# EAGLE design mcu_teensy4.1 (EAGLE 9.6.1)
c't-Bot v2 MCU Board; CC BY-SA 4.0, Timo Sandmann
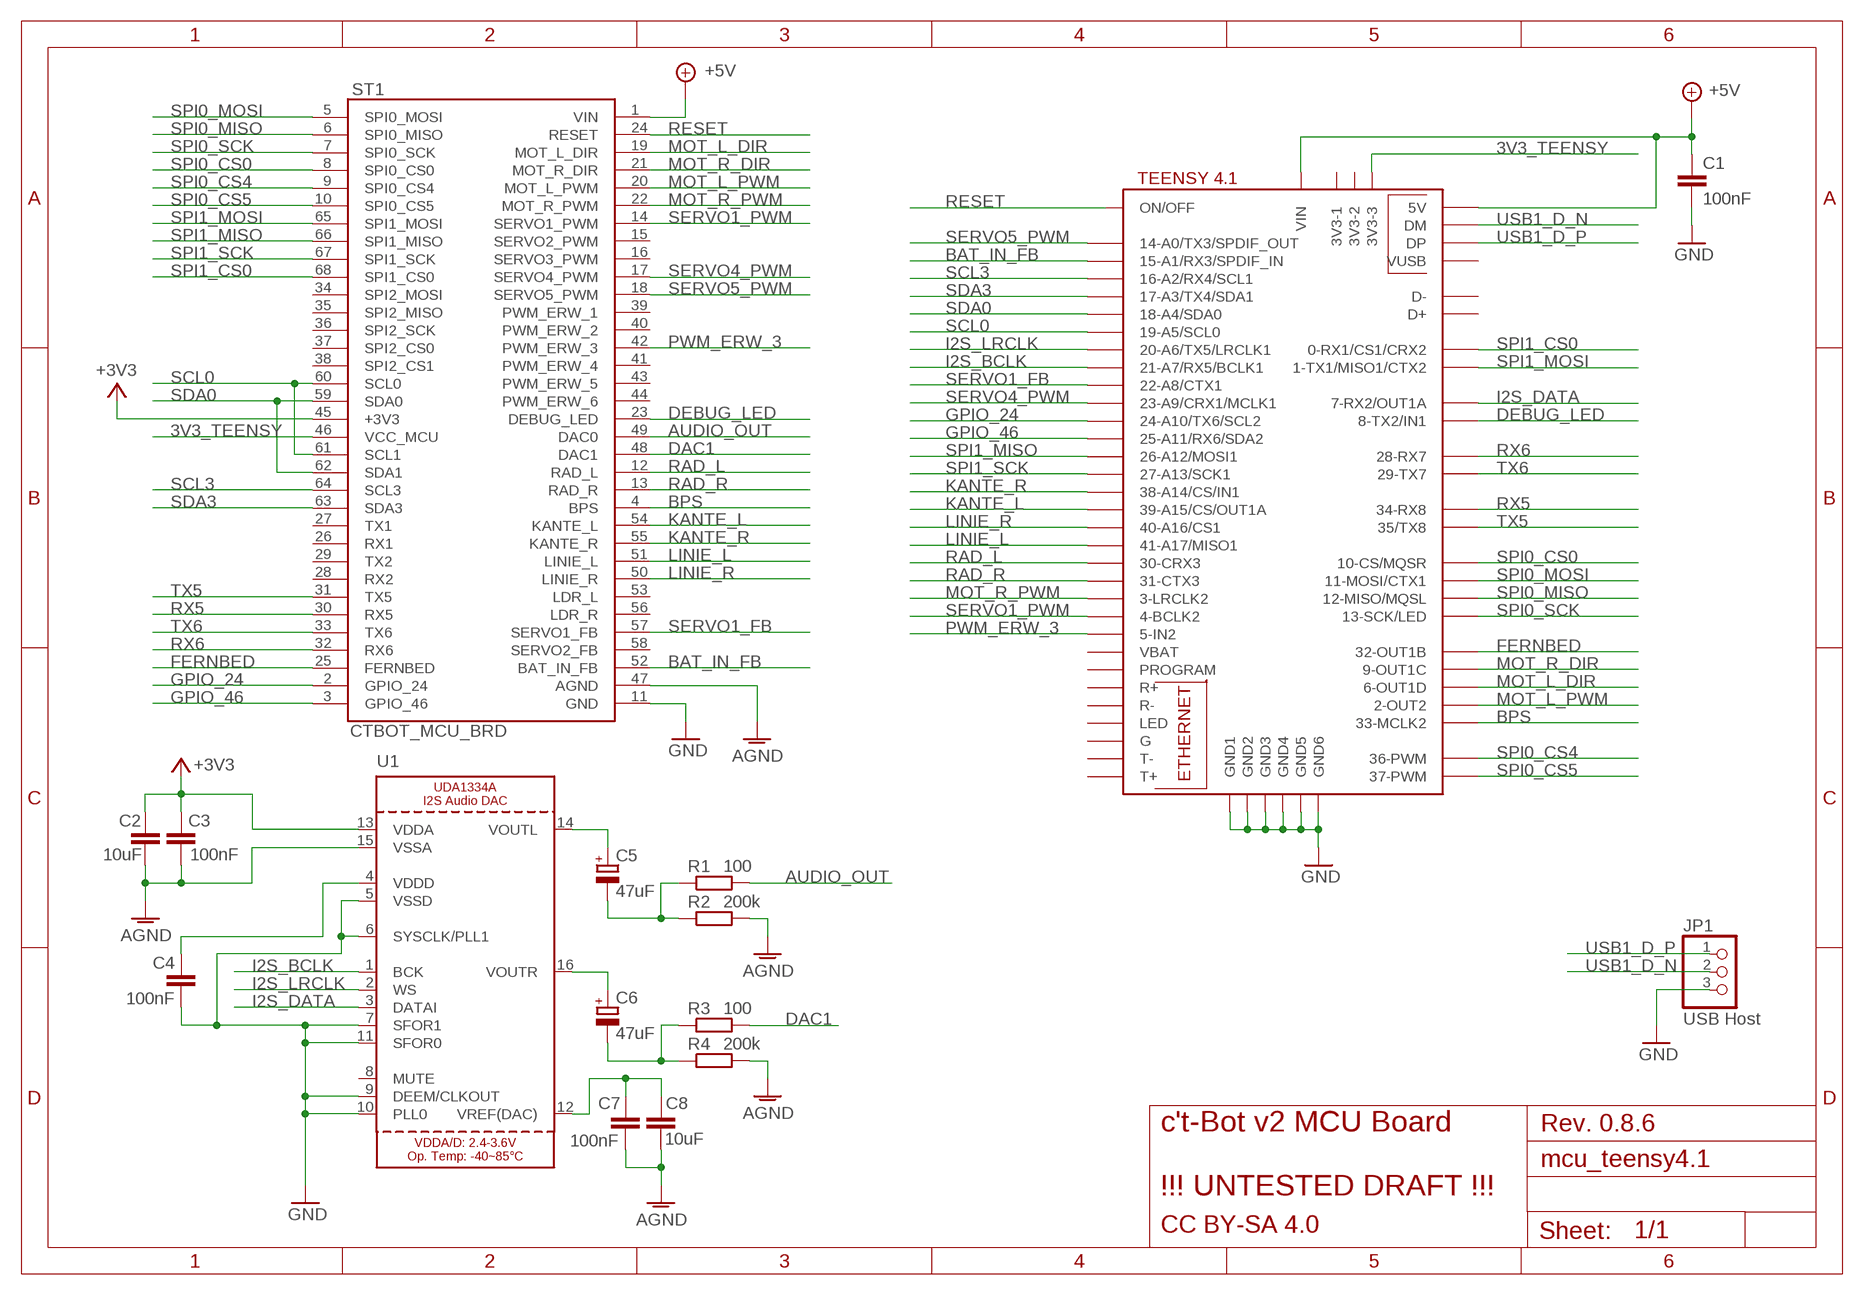
[diagram p0: schematic, sheet 1]

## Parts
C1  100nF  C-EUC0805  [C0805]
C2  10uF  C-EUC0805  [C0805]
C3  100nF  C-EUC0805  [C0805]
C4  100nF  C-EUC0805  [C0805]
C5  47uF  CPOL-EUUD-6,3X8,8  [UD-6,3X5,8_NICHICON]
C6  47uF  CPOL-EUUD-6,3X8,8  [UD-6,3X5,8_NICHICON]
C7  100nF  C-EUC0805  [C0805]
C8  10uF  C-EUC0805  [C0805]
JP1  USB Host  PINHD-1X3/90  [1X03/90]
R1  100  R-EU_R0805  [R0805]
R2  200k  R-EU_R0805  [R0805]
R3  100  R-EU_R0805  [R0805]
R4  200k  R-EU_R0805  [R0805]
ST1  CTBOT_MCU_BRD  [DIP66]
U1  AUDIO_I2S_UDA1334""  [SSOP16_4.4MM]
U$1  TEENSY41  [TEENSY41]

## Nets
3V3_TEENSY: ST1.46(VCC_MCU) U$1.3V3-3
+3V3: C2.1 C3.2 ST1.45(+3V3) U1.13(VDDA)
+5V: C1.1 ST1.1(VIN) U$1.+5V(5V) U$1.VIN
AGND: C2.2 C3.1 C7.1 C8.1 R2.2 R4.2 ST1.47(AGND) U1.15(VSSA)
AUDIO_OUT: R1.2 ST1.49(DAC0)
BAT_IN_FB: ST1.52(BAT_IN_FB) U$1.15-A1/RX3/SPDIF_IN
BPS: ST1.4(BPS) U$1.33-MCLK2
DAC1: R3.2 ST1.48(DAC1)
DEBUG_LED: ST1.23(DEBUG_LED) U$1.8-TX2/IN1
FERNBED: ST1.25(FERNBED) U$1.32-OUT1B
GND: C1.2 C4.1 JP1.3 ST1.11(GND) U1.5(VSSD) U1.6(SYSCLK/PLL1) U1.7(SFOR1) U1.9(DEEM/CLKOUT) U1.10(PLL0) U1.11(SFOR0) U$1.GND1 U$1.GND2 U$1.GND3 U$1.GND4 U$1.GND5 U$1.GND6
GPIO_24: ST1.2(GPIO_24) U$1.24-A10/TX6/SCL2
GPIO_46: ST1.3(GPIO_46) U$1.25-A11/RX6/SDA2
I2S_BCLK: U1.1(BCK) U$1.21-A7/RX5/BCLK1
I2S_DATA: U1.3(DATAI) U$1.7-RX2/OUT1A
I2S_LRCLK: U1.2(WS) U$1.20-A6/TX5/LRCLK1
KANTE_L: ST1.54(KANTE_L) U$1.39-A15/CS/OUT1A
KANTE_R: ST1.55(KANTE_R) U$1.38-A14/CS/IN1
LINIE_L: ST1.51(LINIE_L) U$1.41-A17/MISO1
LINIE_R: ST1.50(LINIE_R) U$1.40-A16/CS1
MOT_L_DIR: ST1.19(MOT_L_DIR) U$1.6-OUT1D
MOT_L_PWM: ST1.20(MOT_L_PWM) U$1.2-OUT2
MOT_R_DIR: ST1.21(MOT_R_DIR) U$1.9-OUT1C
MOT_R_PWM: ST1.22(MOT_R_PWM) U$1.3-LRCLK2
N$1: C7.2 C8.2 U1.12(VREF(DAC))
N$2: C5.+ U1.14(VOUTL)
N$3: C4.2 U1.4(VDDD)
N$4: C6.+ U1.16(VOUTR)
N$5: C5.- R1.1 R2.1
N$6: C6.- R3.1 R4.1
PWM_ERW_3: ST1.42(PWM_ERW_3) U$1.5-IN2
RAD_L: ST1.12(RAD_L) U$1.30-CRX3
RAD_R: ST1.13(RAD_R) U$1.31-CTX3
RESET: ST1.24(RESET) U$1.ON/OFF
RX5: ST1.30(RX5) U$1.34-RX8
RX6: ST1.32(RX6) U$1.28-RX7
SCL0: ST1.60(SCL0) ST1.61(SCL1) U$1.19-A5/SCL0
SCL3: ST1.64(SCL3) U$1.16-A2/RX4/SCL1
SDA0: ST1.59(SDA0) ST1.62(SDA1) U$1.18-A4/SDA0
SDA3: ST1.63(SDA3) U$1.17-A3/TX4/SDA1
SERVO1_FB: ST1.57(SERVO1_FB) U$1.22-A8/CTX1
SERVO1_PWM: ST1.14(SERVO1_PWM) U$1.4-BCLK2
SERVO4_PWM: ST1.17(SERVO4_PWM) U$1.23-A9/CRX1/MCLK1
SERVO5_PWM: ST1.18(SERVO5_PWM) U$1.14-A0/TX3/SPDIF_OUT
SPI0_CS0: ST1.8(SPI0_CS0) U$1.10-CS\MQSR(10-CS/MQSR)
SPI0_CS4: ST1.9(SPI0_CS4) U$1.36-PWM
SPI0_CS5: ST1.10(SPI0_CS5) U$1.37-PWM
SPI0_MISO: ST1.6(SPI0_MISO) U$1.12-MISO/MQSL
SPI0_MOSI: ST1.5(SPI0_MOSI) U$1.11-MOSI/CTX1
SPI0_SCK: ST1.7(SPI0_SCK) U$1.13-SCK/LED
SPI1_CS0: ST1.68(SPI1_CS0) U$1.0-RX1/CS1/CRX2
SPI1_MISO: ST1.66(SPI1_MISO) U$1.26-A12/MOSI1
SPI1_MOSI: ST1.65(SPI1_MOSI) U$1.1-TX1/MISO1/CTX2
SPI1_SCK: ST1.67(SPI1_SCK) U$1.27-A13/SCK1
TX5: ST1.31(TX5) U$1.35-TX8(35/TX8)
TX6: ST1.33(TX6) U$1.29-TX7
USB1_D_N: JP1.2 U$1.DM
USB1_D_P: JP1.1 U$1.DP
Unconnected: ST1.15(SERVO2_PWM) ST1.16(SERVO3_PWM) ST1.26(RX1) ST1.27(TX1) ST1.28(RX2) ST1.29(TX2) ST1.34(SPI2_MOSI) ST1.35(SPI2_MISO) ST1.36(SPI2_SCK) ST1.37(SPI2_CS0) ST1.38(SPI2_CS1) ST1.39(PWM_ERW_1) ST1.40(PWM_ERW_2) ST1.41(PWM_ERW_4) ST1.43(PWM_ERW_5) ST1.44(PWM_ERW_6) ST1.53(LDR_L) ST1.56(LDR_R) ST1.58(SERVO2_FB) U1.8(MUTE) U$1.3V3-1 U$1.3V3-2 U$1.D+ U$1.D- U$1.G U$1.LED U$1.PROGRAM U$1.R+ U$1.R- U$1.T+ U$1.T- U$1.VBAT U$1.VUSB

## Notes on the sheet
- Rev. 0.8.6
- c't-Bot v2 MCU Board
  
  !!! UNTESTED DRAFT !!!
- CC BY-SA 4.0

## Library data of the parts
C1-C4 C7 C8 = rcl:C-EU: CAPACITOR, European symbol; SPICEPREFIX: C
C5 C6 = rcl:CPOL-EU: POLARIZED CAPACITOR, European symbol; SPICEPREFIX: C
JP1 = pinhead_ts:PINHD-1X3: PIN HEADER
R1-R4 = rcl:R-EU_: RESISTOR, European symbol; SPICEPREFIX: R
ST1 = ct-bot:CTBOT_MCU_BRD
U1 = ct-bot:AUDIO_I2S_UDA1334: UDA1334 I2C Audio DAC Power Supply: 2.4-3.6V Sample frequencies from 16-100kHz
U$1 = teensy:TEENSY41

## Board
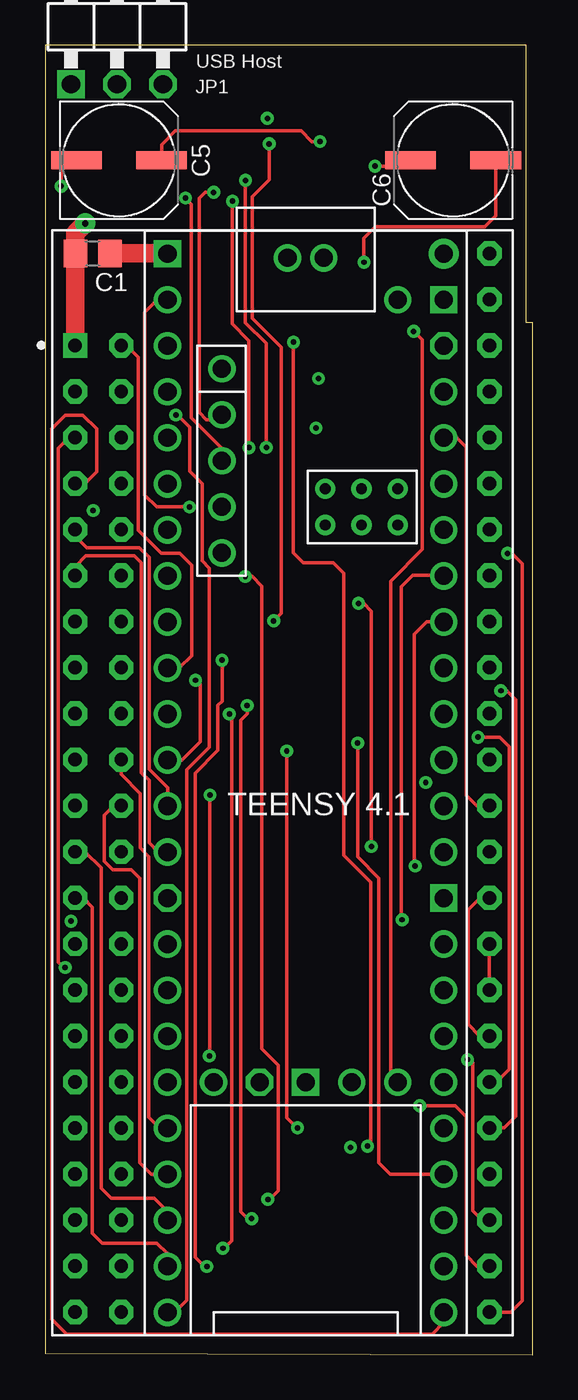
[diagram p1: board, top side]
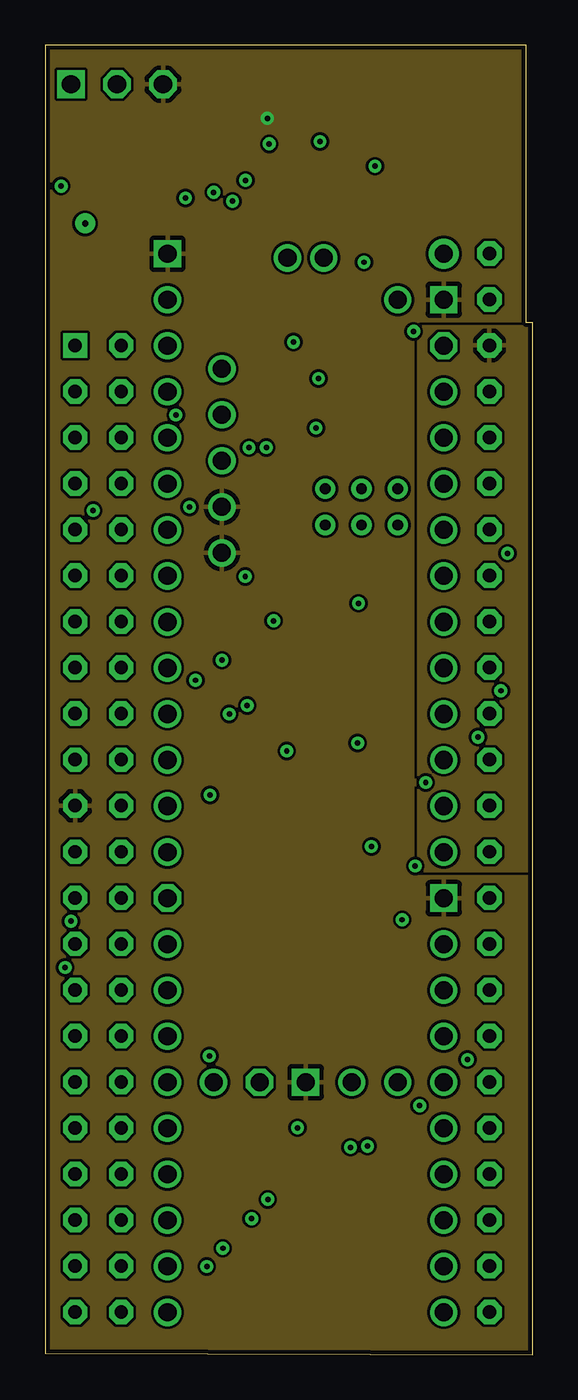
[diagram p2: board, inner layer GND]
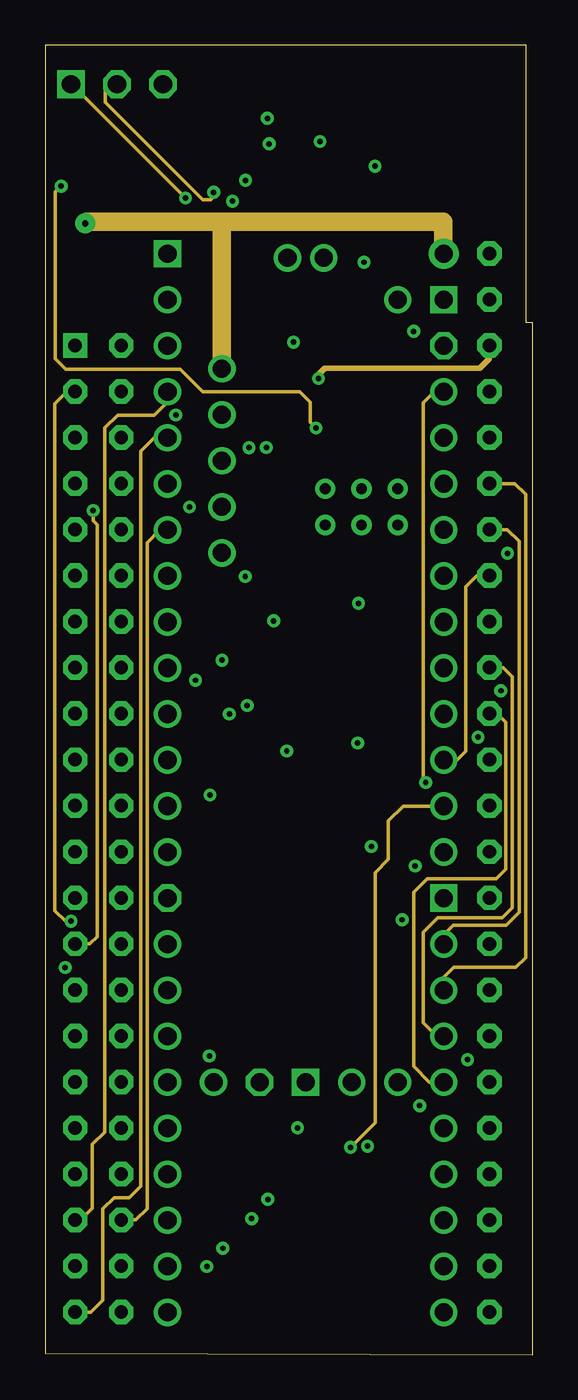
[diagram p3: board, inner layer ANALOG]
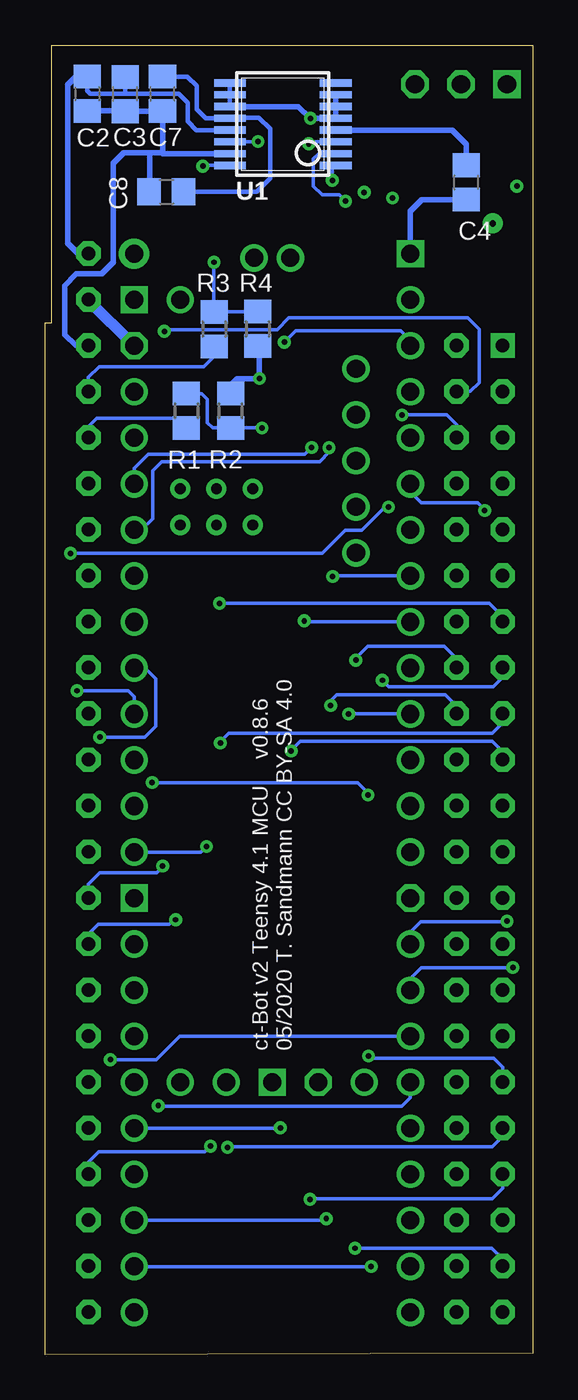
[diagram p4: board, bottom side, seen from below]

Size 26.89 x 72.25 mm. Coordinates in mm from the lower left corner, seen from the top.
Outline: 0,0.07 26.89,0 26.89,56.95 26.54,56.95 26.54,72.25 0,72.25 0,0.07
Copper layers (1+2*15+16): Top 0.035mm / dielectric 0.2mm / GND 0.0175mm / dielectric 1.065mm / ANALOG 0.0175mm / dielectric 0.2mm / Bottom 0.035mm
Design rules "jlcpcb_4layer_DRU": minimum track width 6mil, minimum drill 0.3mm, track to track 6mil, track to pad 6mil, pad to pad 6mil, via to via 6mil, smd to smd 6mil, copper to edge 10mil, drill to drill 6mil, minimum pad ring 10mil, minimum via ring 8mil, stop-mask expansion 4mil, vias tented up to drill 0mil, thermal gap 10mil

### Footprints (pad centres in the part's own frame; a part is rotated, then mirrored left to right if it is on the bottom)
C0805 = smd 1.3 x 1.5: 1 -0.95,0; 2 0.95,0
UD-6,3X5,8_NICHICON = smd 2.8 x 1: + 2.35,0; - -2.35,0
1X03/90 = drill 1.016 square: 1 -2.54,-3.81 | drill 1.016 octagon: 2 0,-3.81; 3 2.54,-3.81
R0805 = smd 1.3 x 1.5: 1 -0.95,0; 2 0.95,0
DIP66 = drill 0.743 pad 1.343 square: 1 -11.43,25.4 | drill 0.743 pad 1.343 octagon: 2 -11.43,22.86; 3 -11.43,20.32; 4 -11.43,17.78; 5 -11.43,15.24; 6 -11.43,12.7; 7 -11.43,10.16; 8 -11.43,7.62; 9 -11.43,5.08; 10 -11.43,2.54; 11 -11.43,0; 12 -11.43,-2.54; 13 -11.43,-5.08; 14 -11.43,-7.62; 15 -11.43,-10.16; 16 -11.43,-12.7; 17 -11.43,-15.24; 18 -11.43,-17.78; 19 -11.43,-20.32; 20 -11.43,-22.86; 21 -11.43,-25.4; 22 -11.43,-27.94; 23 -8.89,25.4; 24 -8.89,22.86; 25 -8.89,20.32; 26 -8.89,17.78; 27 -8.89,15.24; 28 -8.89,12.7; 29 -8.89,10.16; 30 -8.89,7.62; 31 -8.89,5.08; 32 -8.89,2.54; 33 -8.89,0; 34 -8.89,-2.54; 35 -8.89,-5.08; 36 -8.89,-7.62; 37 -8.89,-10.16; 38 -8.89,-12.7; 39 -8.89,-15.24; 40 -8.89,-17.78; 41 -8.89,-20.32; 42 -8.89,-22.86; 43 -8.89,-25.4; 44 -8.89,-27.94; 45 11.43,30.48; 46 11.43,27.94; 47 11.43,25.4; 48 11.43,22.86; 49 11.43,20.32; 50 11.43,17.78; 51 11.43,15.24; 52 11.43,12.7; 53 11.43,10.16; 54 11.43,7.62; 55 11.43,5.08; 56 11.43,2.54; 57 11.43,0; 58 11.43,-2.54; 59 11.43,-5.08; 60 11.43,-7.62; 61 11.43,-10.16; 62 11.43,-12.7; 63 11.43,-15.24; 64 11.43,-17.78; 65 11.43,-20.32; 66 11.43,-22.86; 67 11.43,-25.4; 68 11.43,-27.94
SSOP16_4.4MM = smd 0.4 x 1.75: 1 -2.275,-2.92; 2 -1.625,-2.92; 3 -0.975,-2.92; 4 -0.325,-2.92; 5 0.325,-2.92; 6 0.975,-2.92; 7 1.625,-2.92; 8 2.275,-2.92; 9 2.275,2.92; 10 1.625,2.92; 11 0.975,2.92; 12 0.325,2.92; 13 -0.325,2.92; 14 -0.975,2.92; 15 -1.625,2.92; 16 -2.275,2.92
TEENSY41 = drill 1: 0-RX1/CS1/CRX2 -27.94,-7.62; 1-TX1/MISO1/CTX2 -25.4,-7.62; 2-OUT2 -22.86,-7.62; 3-LRCLK2 -20.32,-7.62; 4-BCLK2 -17.78,-7.62; 5-IN2 -15.24,-7.62; 6-OUT1D -12.7,-7.62; 7-RX2/OUT1A -10.16,-7.62; 8-TX2/IN1 -7.62,-7.62; 9-OUT1C -5.08,-7.62; 10-CS\MQSR -2.54,-7.62; 11-MOSI/CTX1 0,-7.62; 12-MISO/MQSL 2.54,-7.62; 13-SCK/LED 2.54,7.62; 14-A0/TX3/SPDIF_OUT 0,7.62; 15-A1/RX3/SPDIF_IN -2.54,7.62; 16-A2/RX4/SCL1 -5.08,7.62; 17-A3/TX4/SDA1 -7.62,7.62; 18-A4/SDA0 -10.16,7.62; 19-A5/SCL0 -12.7,7.62; 20-A6/TX5/LRCLK1 -15.24,7.62; 21-A7/RX5/BCLK1 -17.78,7.62; 22-A8/CTX1 -20.32,7.62; 23-A9/CRX1/MCLK1 -22.86,7.62; 24-A10/TX6/SCL2 7.62,-7.62; 25-A11/RX6/SDA2 10.16,-7.62; 26-A12/MOSI1 12.7,-7.62; 27-A13/SCK1 15.24,-7.62; 28-RX7 17.78,-7.62; 29-TX7 20.32,-7.62; 30-CRX3 22.86,-7.62; 31-CTX3 25.4,-7.62; 32-OUT1B 27.94,-7.62; 33-MCLK2 27.94,7.62; 34-RX8 25.4,7.62; 35-TX8 22.86,7.62; 36-PWM 20.32,7.62; 37-PWM 17.78,7.62; 38-A14/CS/IN1 15.24,7.62; 39-A15/CS/OUT1A 12.7,7.62; 40-A16/CS1 10.16,7.62; 41-A17/MISO1 7.62,7.62; +5V -24.13,-4.62; D+ -30.25,-1; D- -30.25,1; DM -21.59,-4.62; DP -19.05,-4.62; GND4 -16.51,-4.62; GND5 -13.97,-4.62; ON/OFF 15.24,5.08; PROGRAM 15.24,2.54; VBAT 15.24,-5.08; VUSB -27.94,5.08 | drill 1 octagon: 3V3-1 5.08,-7.62; 3V3-2 15.24,-2.54; 3V3-3 -25.4,7.62 | drill 0.6: G -15.51,3.08; LED -17.51,3.08; R+ -17.51,5.08; R- -15.51,5.08; T+ -15.51,1.08; T- -17.51,1.08 | drill 1 square: GND1 -30.48,-7.62; GND2 15.24,0; GND3 5.08,7.62; GND6 -27.94,7.62 | drill 1 pad 1.676: VIN -30.48,7.62

### Placement (x,y rotation side)
C1  2.61,60.77 0 top
C2  24.58,69.58 270 bottom
C3  22.48,69.57 90 bottom
C4  3.66,64.69 90 bottom
C5  4.07,65.91 0 top
C6  22.5,65.91 180 top
C7  20.42,69.57 90 bottom
C8  20.21,64.17 0 bottom
JP1  3.96,73.91 0 top
R1  19.1,52.09 270 bottom
R2  16.66,52.09 90 bottom
R3  17.57,56.59 270 bottom
R4  15.17,56.6 270 bottom
ST1  13.08,30.29 0 top
U1  13.78,67.9 90 bottom
U$1  14.37,30.27 270 top

### Tracks (layer width: path | path; a pad name or v marks a point on that pad's centre or on a via)
3V3_TEENSY
  Bottom 0.61: U$1.3V3-3 24.51,58.2 ST1.46
+3V3
  Bottom 0.254: 22.48,69.58 19.52,69.58 19.03,69.1 19.03,68.05 18.56,67.58 U1.13 | C3.2 22.48,69.58 | 22.48,69.58 24.41,69.58 24.58,69.75 24.58,70.19
  Bottom 0.305: 24.58,70.19 C2.1 24.59,70.54 25.18,70.54 25.64,70.08 25.64,61.32 25.1,60.77 ST1.45
+5V  (via drill 0.35 pad 1.1)
  Top 1.016: ST1.1 1.65,60.76 C1.1 1.66,61.89 v2.2,62.43
  ANALOG 1.016: 9.8,62.5 2.28,62.5 v2.2,62.43 | U$1.+5V 9.75,62.45 9.8,62.5 | 9.8,62.5 21.95,62.5 21.95,60.79 U$1.VIN
AGND  (via drill 0.3)
  ANALOG 0.305: ST1.47 24.51,54.96 23.98,54.43 15.42,54.43 15.07,54.08 v15.07,53.87
  Bottom 0.305: ST1.47 25.21,55.69 25.81,56.29 25.81,59 25.17,59.64 23.78,59.64 23.13,60.29 23.13,65.75 22.56,66.31 21.14,66.31 | U1.15 20.42,66.28 20.42,66.31 | 20.42,66.31 21.14,66.31 | 20.42,66.31 C7.1 C3.1 22.5,68.63 C2.2 | C8.1 21.14,64.2 21.14,66.31 | R4.2 15.07,55.55 v15.07,53.87 16.29,53.87 16.66,53.49 R2.2
  pour GND (rank 2): 20.6,56.72 28.14,56.72 28.14,26.7 20.6,26.7
AUDIO_OUT
  Bottom 0.203: ST1.49 24.51,51.22 24.04,51.68 19.53,51.68 19.1,51.26 R1.2
BAT_IN_FB
  ANALOG 0.203: U$1.15-A1/RX3/SPDIF_IN 22.71,32.81 23.2,33.31 23.2,42.38 23.81,42.99 ST1.52
BPS
  Top 0.203: U$1.33-MCLK2 21.99,1.78 21.34,1.14 2.9,1.14 1.18,1.14 0.36,1.96 0.36,51.09 1.11,51.84 2.08,51.84 2.83,51.09 2.83,48.72 2.19,48.07 ST1.4
DAC1
  Bottom 0.203: R3.2 17.57,55.11 18.15,54.53 23.91,54.53 24.51,53.93 ST1.48
DEBUG_LED
  Top 0.203: U$1.8-TX2/IN1 7.4,37.89 8.08,38.58 8.08,43.56 7.41,44.23 6.39,44.23 5.14,45.49 5.14,55.03 4.48,55.69 ST1.23
FERNBED  (via drill 0.3)
  Top 0.203: U$1.32-OUT1B 7.14,2.33 7.8,2.99 7.8,32.27 9.05,33.52 9.05,43.4 8.65,43.8 8.65,48.05 7.96,48.74 7.96,51.18 7.29,51.86 v7.21,51.86
  Bottom 0.203: v7.21,51.86 4.73,51.86 4.19,51.31 ST1.25
GND  (via drill 0.3)
  Top 1.016: C1.2 U$1.GND1
  Bottom 0.254: U1.11 U1.10 | U1.10 U1.9 | U1.7 | U1.10
  Bottom 0.305: U1.7 U1.6 U1.5 v12.25,68.23 v12.25,68.22 12.27,68.22 12.93,68.88 U1.11 | C4.1 6.11,63.74 6.75,63.1 U$1.GND1
  pour GND (rank 6): -0.89,72.63 28.5,72.63 28.5,-0.44 -0.89,-0.44
GPIO_24  (via drill 0.3)
  ANALOG 0.203: v1.42,23.92 1.11,23.92 0.53,24.51 0.53,52.48 1.2,53.15 ST1.2
  Bottom 0.203: U$1.24-A10/TX6/SCL2 6.75,23.31 6.16,23.89 1.45,23.89 v1.42,23.92
GPIO_46  (via drill 0.3)
  Top 0.203: v1.09,21.36 1.03,21.36 0.72,21.67 0.72,50.02 1.32,50.61 ST1.3
  Bottom 0.203: U$1.25-A11/RX6/SDA2 6.75,20.75 6.14,21.35 v1.1,21.35 v1.09,21.36
I2S_BCLK  (via drill 0.3)
  Top 0.203: v11.05,64.8 11.05,64.78 11.04,64.78 11.04,56.96 12.19,55.8 v12.19,50.06
  Bottom 0.203: U$1.21-A7/RX5/BCLK1 21.99,48.9 21.21,49.68 12.57,49.68 v12.19,50.06 | v11.05,64.8 11.06,64.81 11.06,65.43 U1.1
I2S_DATA  (via drill 0.3)
  Top 0.203: v12.35,66.82 12.35,64.84 11.42,63.9 11.42,57.19 13.03,55.58 13.03,40.93 v12.6,40.5
  Bottom 0.203: U$1.7-RX2/OUT1A 12.54,40.43 v12.6,40.5 | U1.3 12.25,66.93 v12.35,66.83 v12.35,66.82
I2S_LRCLK  (via drill 0.3)
  Top 0.203: v11.24,50.05 11.24,55.95 10.32,56.88 v10.32,63.64 v10.33,63.65
  Bottom 0.203: U$1.20-A6/TX5/LRCLK1 21.59,45.51 20.97,46.13 20.97,48.78 20.47,49.28 11.75,49.28 11.24,49.79 v11.24,50.05 | U1.2 11.81,66.28 12.1,65.99 12.1,64.47 11.62,63.99 10.67,63.99 v10.33,63.65
KANTE_L
  ANALOG 0.203: ST1.54 25.28,37.91 25.78,37.42 25.78,24.67 25.22,24.11 21.64,24.11 20.85,23.32 20.85,18.32 21.6,17.57 U$1.39-A15/CS/OUT1A
KANTE_R
  ANALOG 0.203: ST1.55 24.92,35.37 25.4,34.89 25.4,26.77 24.89,26.26 21.09,26.26 20.33,25.5 20.33,15.9 21.2,15.03 U$1.38-A14/CS/IN1
LINIE_L
  ANALOG 0.203: ST1.51 25.5,45.53 26.14,44.89 26.14,24.41 25.42,23.7 22.51,23.7 21.99,23.17 U$1.41-A17/MISO1
LINIE_R
  ANALOG 0.203: ST1.50 25.92,48.07 26.51,47.48 26.51,21.91 25.97,21.38 22.54,21.38 21.98,20.82 U$1.40-A16/CS1
MOT_L_DIR  (via drill 0.3)
  Top 0.203: v12.28,8.57 12.38,8.57 12.86,9.05 12.86,15.97 11.94,16.89 11.94,42.42 11.41,42.95 v11.03,42.95
  Bottom 0.203: ST1.19 1.65,9.17 2.22,8.6 12.25,8.6 v12.28,8.57 | v11.03,42.95 11,42.98 U$1.6-OUT1D
MOT_L_PWM
  ANALOG 0.203: ST1.20 1.96,7.43 2.6,8.07 2.6,11.61 3.28,12.29 3.28,51.14 3.99,51.85 6,51.85 6.75,52.6 U$1.2-OUT2
MOT_R_DIR  (via drill 0.3)
  Top 0.203: v9.8,5.87 9.88,5.87 10.29,6.29 10.29,35.2 10.15,35.34 v10.15,35.35
  Bottom 0.203: ST1.21 1.65,5.28 2.25,5.88 v9.79,5.88 v9.8,5.87 | v10.15,35.35 U$1.9-OUT1C | U$1.9-OUT1C
MOT_R_PWM
  ANALOG 0.203: ST1.22 2.52,2.35 3.18,3.01 3.18,8.05 3.79,8.67 4.63,8.67 5.26,9.3 5.26,49.85 6,50.59 U$1.3-LRCLK2
N$1
  Bottom 0.254: C8.2 15.22,64.17 14.49,64.9 14.49,67.64 15.11,68.27 16.66,68.27 U1.12 18.03,68.23 18.54,68.73 18.54,70.01 19.04,70.52 C7.2
N$2  (via drill 0.3)
  Top 0.203: C5.+ 6.42,66.78 7.17,67.53 14.13,67.53 14.71,66.94 v15.15,66.94
  Bottom 0.203: v15.15,66.94 15.17,66.93 U1.14
N$3
  Bottom 0.305: U1.4 4.43,67.58 3.66,66.8 C4.2
N$4  (via drill 0.3)
  Top 0.203: C6.+ 19.83,65.58 v18.2,65.58
  Bottom 0.203: v18.2,65.58 18.15,65.63 U1.16
N$5  (via drill 0.3)
  Top 0.203: v0.87,64.48 0.87,65.52 1.25,65.91 C5.-
  ANALOG 0.203: v0.87,64.48 0.55,64.16 0.55,54.97 1.14,54.38 7.45,54.38 8.7,53.13 14.05,53.13 14.63,52.55 14.63,51.44 v14.94,51.14
  Bottom 0.203: R2.1 17.65,51.14 17.94,51.43 17.94,52.73 18.26,53.04 R1.1 | v14.94,51.14 R2.1 | R2.1
N$6  (via drill 0.3)
  Top 0.203: C6.- 24.85,62.85 24.25,62.25 18.22,62.25 17.58,61.61 v17.58,60.28
  Bottom 0.203: R4.1 R3.1 v17.58,60.28
PWM_ERW_3
  ANALOG 0.203: ST1.42 4.98,7.43 5.62,8.07 5.62,44.8 6.33,45.51 U$1.5-IN2
RAD_L
  Top 0.203: ST1.12 2.19,27.75 3.07,26.87 3.07,9.18 3.63,8.63 6.01,8.63 6.75,7.89 U$1.30-CRX3
RAD_R
  Top 0.203: ST1.13 2.08,25.21 2.6,24.7 2.6,6.7 3.14,6.16 6.15,6.16 6.75,5.56 U$1.31-CTX3
RESET  (via drill 0.3)
  Top 0.203: U$1.ON/OFF 19.17,15.03 19.05,15.15 19.05,42.69 20.8,44.44 20.8,56 20.34,56.47 v20.32,56.47
  Bottom 0.203: v20.32,56.47 20.23,56.56 14.09,56.56 13.45,57.21 3.57,57.21 2.95,56.59 2.95,53.64 3.44,53.15 ST1.24
RX5  (via drill 0.3)
  Top 0.203: v8.91,4.86 8.79,4.86 8.26,5.38 8.26,32.09 9.52,33.35 9.52,35.83 9.75,36.07 v9.75,38.32
  Bottom 0.203: U$1.34-RX8 21.97,4.86 v8.91,4.86 | v9.75,38.32 9.75,38.42 9.09,39.08 4.86,39.08 4.19,38.41 ST1.30
RX6
  Top 0.203: ST1.32 4.19,32.02 5.25,30.96 5.25,27.96 5.72,27.49 5.72,13.1 6.32,12.49 U$1.28-RX7
SCL0  (via drill 0.3)
  Top 0.203: v19.69,24 19.63,24.06 19.63,42.37 20.28,43.02 21.94,43.02 U$1.19-A5/SCL0 | ST1.61 ST1.60
  Bottom 0.203: ST1.60 24.51,23.21 23.96,23.76 20.05,23.76 19.81,24 v19.69,24
SCL3  (via drill 0.3)
  Top 0.203: ST1.64 25.32,12.51 25.96,13.15 25.96,36.14 25.47,36.64 v25.14,36.64
  Bottom 0.203: v25.14,36.64 22.3,36.64 21.99,36.32 U$1.16-A2/RX4/SCL1
SDA0  (via drill 0.3)
  Top 0.203: v20.41,26.97 20.36,27.02 20.36,39.75 21.05,40.44 U$1.18-A4/SDA0 | ST1.62 23.96,17.59 23.33,18.22 23.33,24.55 23.99,25.21 ST1.59
  Bottom 0.203: ST1.59 24.51,25.96 23.88,26.59 20.74,26.59 20.41,26.92 v20.41,26.97
SDA3  (via drill 0.3)
  Top 0.203: ST1.63 24.92,15.05 25.61,15.74 25.61,33.56 25.08,34.08 v23.88,34.08
  Bottom 0.203: v23.88,34.08 21.39,34.08 20.8,34.67 20.8,37.29 21.41,37.89 U$1.17-A3/TX4/SDA1
SERVO1_FB
  Top 0.203: ST1.57 23.81,30.29 23.23,30.87 23.23,50.06 22.7,50.59 U$1.22-A8/CTX1
SERVO1_PWM  (via drill 0.3)
  ANALOG 0.203: ST1.14 2.46,22.67 2.86,23.07 2.86,45.79 2.64,46.01 v2.64,46.58
  Bottom 0.203: U$1.4-BCLK2 6.75,47.62 6.15,47.02 3.02,47.02 2.64,46.65 v2.64,46.58
SERVO4_PWM  (via drill 0.3)
  Top 0.203: v9.08,30.89 9.08,16.47 9.07,16.47 v9.05,16.48
  ANALOG 0.203: U$1.23-A9/CRX1/MCLK1 21.47,53.13 20.86,52.53 20.86,31.7 v20.99,31.57
  Bottom 0.203: v9.08,30.89 9.08,31.02 9.64,31.57 v20.99,31.57 | v9.05,16.48 8.94,16.37 2.15,16.37 1.65,15.87 ST1.17
SERVO5_PWM  (via drill 0.3)
  ANALOG 0.203: v16.84,11.44 v16.85,11.44 18.2,12.79 18.2,26.6 18.93,27.34 18.93,29.46 19.74,30.27 U$1.14-A0/TX3/SPDIF_OUT
  Bottom 0.203: ST1.18 1.65,12.04 2.22,11.47 16.81,11.47 v16.84,11.44
SPI0_CS0  (via drill 0.3)
  Top 0.203: v8.29,37.22 8.54,36.97 8.54,33.82 7.53,32.81 U$1.10-CS\MQSR
  Bottom 0.203: ST1.8 1.65,37.39 2.18,36.86 7.94,36.86 v8.29,37.22
SPI0_CS4  (via drill 0.3)
  Top 0.203: v17.23,33.76 17.23,27.48 18.41,26.3 18.41,10.59 19.04,9.95 U$1.36-PWM
  Bottom 0.203: ST1.9 1.65,34.86 2.21,34.3 16.77,34.3 17.23,33.83 v17.23,33.76
SPI0_CS5  (via drill 0.3)
  Top 0.203: v13.92,12.52 13.88,12.52 13.31,13.09 v13.31,33.31 v13.32,33.31
  Bottom 0.203: U$1.37-PWM 13.94,12.49 v13.92,12.52 | ST1.10 1.65,33.27 2.24,33.85 12.83,33.85 13.32,33.36 v13.32,33.31
SPI0_MISO
  Top 0.203: ST1.6 1.65,43.49 2.24,44.08 4.92,44.08 5.29,43.7 5.29,32.12 5.73,31.69 5.73,28.24 6.24,27.73 U$1.12-MISO/MQSL
SPI0_MOSI
  Top 0.203: ST1.5 1.65,45.16 2.28,44.54 5.18,44.54 5.73,44 5.73,32.29 6.75,31.27 U$1.11-MOSI/CTX1
SPI0_SCK  (via drill 0.3)
  Top 0.203: v17.99,28.04 17.99,41.03 17.56,41.46 v17.28,41.46
  Bottom 0.203: v17.28,41.46 2.38,41.46 1.65,40.73 ST1.7 | v17.99,28.04 18.32,27.72 21.97,27.72 U$1.13-SCK/LED
SPI1_CS0  (via drill 0.3)
  Top 0.203: ST1.68 25.68,2.35 26.32,2.99 26.32,43.65 25.75,44.22 v25.5,44.22 | v7.95,46.78 6.14,46.78 5.49,47.43 5.49,57.53 6.18,58.21 U$1.0-RX1/CS1/CRX2
  Bottom 0.203: v25.5,44.22 11.62,44.22 10.35,45.49 9.42,45.49 8.14,46.78 v7.95,46.78
SPI1_MISO  (via drill 0.3)
  Top 0.203: v23.3,16.28 23.42,16.28 23.59,16.11 23.59,7.94 24.09,7.43 ST1.66
  Bottom 0.203: U$1.26-A12/MOSI1 19.48,17.57 20.77,16.28 v23.3,16.28
SPI1_MOSI  (via drill 0.3)
  Top 0.203: v17.78,11.51 17.95,11.69 17.95,26.08 16.47,27.56 16.47,43.11 15.88,43.7 14.24,43.7 13.69,44.25 v13.69,55.87 v13.7,55.88
  Bottom 0.203: ST1.65 24.51,10.63 23.94,11.19 18.09,11.19 v17.78,11.51 | v13.7,55.88 v13.69,55.88 13.08,56.49 7.28,56.49 6.75,55.96 U$1.1-TX1/MISO1/CTX2
SPI1_SCK  (via drill 0.3)
  Top 0.203: v20.66,13.74 22.61,13.74 23.22,13.14 23.22,5.49 23.82,4.89 ST1.67
  Bottom 0.203: U$1.27-A13/SCK1 6.75,14.19 7.23,13.71 20.51,13.71 20.54,13.74 v20.66,13.74
TX5  (via drill 0.3)
  Top 0.203: v11.39,7.51 11.17,7.51 10.78,7.89 10.78,35.01 11.14,35.37 v11.14,35.82
  Bottom 0.203: U$1.35-TX8 11.48,7.41 v11.39,7.51 | ST1.31 4.19,35.78 4.83,36.42 10.8,36.42 11.14,36.09 v11.14,35.82
TX6
  Top 0.203: ST1.33 3.77,30.29 3.25,29.77 3.25,27.23 3.73,26.75 4.76,26.75 5.21,26.3 5.21,10.59 5.85,9.95 U$1.29-TX7
USB1_D_N  (via drill 0.3)
  Top 0.203: U$1.DM 9.75,51.75 9.59,51.59 8.88,51.59 8.48,51.99 8.48,63.8 8.82,64.14 v9.29,64.14
  ANALOG 0.203: v9.29,64.14 9.29,63.91 9.12,63.74 8.69,63.74 3.3,69.12 3.3,69.69 3.71,70.1 JP1.2
USB1_D_P  (via drill 0.3)
  Top 0.203: U$1.DP 9.75,50.01 8.06,51.69 8.06,63.49 v7.73,63.82
  ANALOG 0.203: v7.73,63.82 7.7,63.85 7.7,63.86 1.45,70.1 JP1.1

### Text on the board
tNames: USB Host
bNames: ct-Bot v2 Teensy 4.1 MCU v0.8.6 / 05/2020 T. Sandmann CC BY-SA 4.0